# EasyEDA schematic SCH_New-Project_2024-12-08_14-09-2234_2024-12-08.json
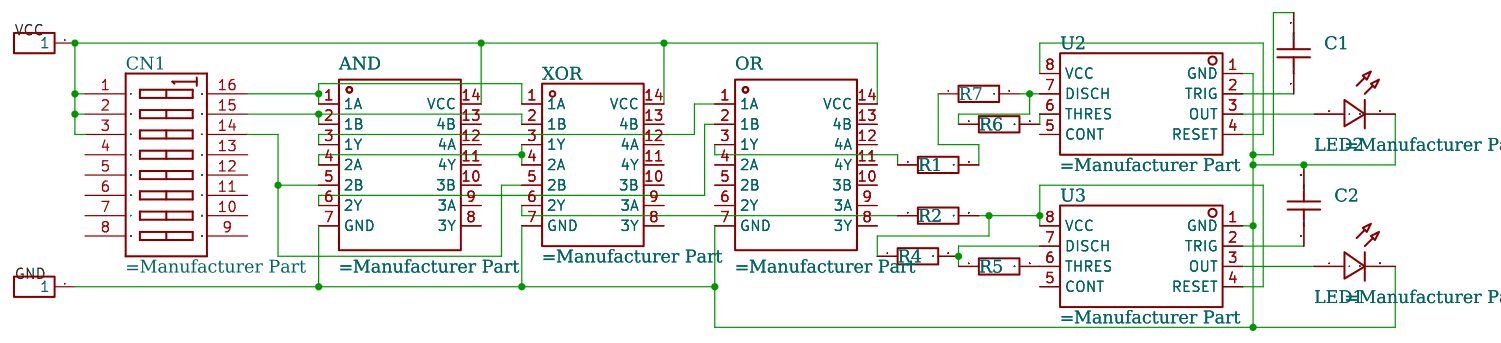
[diagram p0: schematic sheet]

## Parts
AND  =Manufacturer Part  [DIP-14_L19.2-W6.6-P2.54-LS10.9-BL]
C1  100uF  [CAP-TH_BD8.0-P3.50-D0.6-FD-2]
C2  100uF  [CAP-TH_BD8.0-P3.50-D0.6-FD-2]
CN1  =Manufacturer Part  [SW-TH_DS-08RP]
H1  =Manufacturer Part  [CONN-SMD_2059-301-998-403]
H2  =Manufacturer Part  [CONN-SMD_2059-301-998-403]
LED1  =Manufacturer Part  [LED-TH_BD3.2-P2.54-FD]
LED2  =Manufacturer Part  [LED-TH_BD3.2-P2.54-FD]
OR  =Manufacturer Part  [DIP-14_L19.0-W7.0-P2.54-LS7.6-BL]
R1  1kΩ  [R0402]
R2  1kΩ  [R0402]
R4  1kΩ  [R0402]
R5  1kΩ  [R0402]
R6  1kΩ  [R0402]
R7  1kΩ  [R0402]
U2  =Manufacturer Part  [DIP-8_L9.7-W6.4-P2.54-LS7.6-BL]
U3  =Manufacturer Part  [DIP-8_L9.7-W6.4-P2.54-LS7.6-BL]
XOR  =Manufacturer Part  [DIP-14_L20.0-W7.6-P2.54-LS8.0-BL]

## Library data of the parts
AND = -: Logic Gate Type:与门 Number of Channels:4 Supply Voltage:2V6V Supply Voltage:2V6V Quiescent Current (Max):2uA Sink Current:5.2mA Source Current:5.2mA High Level Range (VIH):1.5V4.2V High Level Range (VIH):1.5V4.2V Low Level Range (VIL):500mV1.8V Low Le; Symbol: 74HC08N; Device: SN74HC08N; LCSC Part Name: SN74HC08N; Supplier Part: C2887; Manufacturer: TI(德州仪器); Manufacturer Part: SN74HC08N; Supplier Footprint: DIP-14; JLCPCB Part Class: Extended Part; Datasheet: https://www.ti.com/cn/lit/gpn/sn74hc08; Supplier: LCSC; Add into BOM: yes; Convert to PCB: yes; Logic Gate Type: 与门; Number of Channels: 4; Supply Voltage: 2V6V; Quiescent Current (Max): 2uA; Sink Current: 5.2mA; Source Current: 5.2mA; High Level Range (VIH): 1.5V4.2V; Low Level Range (VIL): 500mV1.8V; Series: 74HCSeries; Propagation Delay Time: 17ns@6V,50pF; Operating Temperature: -40℃+85℃; Comment: SN74HC08N
C1 C2 = -: Capacitance: Tolerance:±20% Tolerance:±20% Rated Voltage: Ripple Current: Equivalent Series Resistance(ESR): Lead Spacing: φD: L: Lifetime @ Temp:; Symbol: CAP; Device: 50YXJ100MT78X11.5; LCSC Part Name: 100uF ±20% 50V; Supplier Part: C440833; Manufacturer: rubycon(红宝石); Manufacturer Part: 50YXJ100MT78X11.5; Supplier Footprint: 插件,D8xL11.5mm; JLCPCB Part Class: Extended Part; Datasheet: https://atta.szlcsc.com/upload/public/pdf/source/20230810/A68D5411C6D60D4A104C9B6E8FF59617.pdf; Supplier: LCSC; Add into BOM: yes; Convert to PCB: yes; Tolerance: ±20%
CN1 = -: Type:平拨,凸起式 Circuit:SPST Number of Positions:8Bit Lead Pitch:2.54mm Current Rating:25mA Voltage Rating:24V Operating Temperature:-20℃+70℃ Operating Temperature:-20℃+70℃ Operating Life:3千次 Color:Red; Symbol: DS-08RP_C5370280; Device: DS-08RP_C458084; LCSC Part Name: 间距2.54mm 平拨,凸起式 8位拨码开关; Supplier Part: C458084; Manufacturer: 韩国韩荣; Manufacturer Part: DS-08RP; Supplier Footprint: 插件; JLCPCB Part Class: Extended Part; Datasheet: https://atta.szlcsc.com/upload/public/pdf/source/20210810/ECF2F28B1CE673E7F9581E27682BDB10.pdf; Supplier: LCSC; Add into BOM: yes; Convert to PCB: yes; Type: 平拨,凸起式; Circuit: SPST; Number of Positions: 8Bit; Lead Pitch: 2.54mm; Current Rating: 25mA; Voltage Rating: 24V; Operating Temperature: -20℃+70℃; Operating Life: 3千次; Color: Red; Comment: DS-08RP
H1 H2 = -: Structure:1x1P Pitch:- Color:White Mounting Style:- Number of Pins:1P Number of PINs Per Row:1 Current Rating (Max):3A Voltage Rating (Max):600V Wire Gauge - AWG:2226 Wire Gauge - mm2:- Operating Temperature Range:-60℃+105℃ Operating Temperature Range:-; Symbol: HDR_1x1; Device: 2059-301/998-403; LCSC Part Name: 1x1P 每排P数:1 排数:1; Supplier Part: C2765059; Manufacturer: WAGO(万可); Manufacturer Part: 2059-301/998-403; Supplier Footprint: SMD,P=3mm; JLCPCB Part Class: Extended Part; Datasheet: https://atta.szlcsc.com/upload/public/pdf/source/20210406/C2765059_FB1B80C52C532D29E58905F06213D89F.pdf; Supplier: LCSC; Add into BOM: yes; Convert to PCB: yes; Structure: 1x1P; Color: White; Number of Pins: 1P; Number of PINs Per Row: 1; Current Rating (Max): 3A; Voltage Rating (Max): 600V; Wire Gauge - AWG: 2226; Operating Temperature Range: -60℃+105℃; Number of Rows: 1; Comment: 2059-301/998-403
LED1 LED2 = -: Lamp Holder Type:3mm圆形灯头 Emitted Color:Green-yellow Forward Voltage (VF):2.1V Forward Voltage (VF):2.1V Power Dissipation:120mW Forward Current:20mA Dominant Wavelength:569nm Dominant Wavelength:569nm Peak Wavelength:565nm Diode Configuration:- Lens Color; Symbol: LED_R; Device: LTL-4231N; LCSC Part Name: 普绿/黄绿; Supplier Part: C125082; Manufacturer: LITEON(光宝); Manufacturer Part: LTL-4231N; Supplier Footprint: 插件,D=3mm; JLCPCB Part Class: Extended Part; Datasheet: https://atta.szlcsc.com/upload/public/pdf/source/20180326/C125082_0C1E1300406BD844B73428E23567D967.pdf; Supplier: LCSC; Add into BOM: yes; Convert to PCB: yes; Lamp Holder Type: 3mm圆形灯头; Emitted Color: Green-yellow; Forward Voltage (VF): 2.1V; Power Dissipation: 120mW; Forward Current: 20mA; Dominant Wavelength: 569nm; Peak Wavelength: 565nm; Lens Color: 雾状绿透镜; Luminous Intensity: 12.6mcd; Viewing Angle: 60°; Operating Temperature: -55℃+100℃; Comment: LTL-4231N
OR = -: Logic Gate Type:ORGate Number of Channels:4 Supply Voltage:2V6V Supply Voltage:2V6V Quiescent Current (Max):2uA Sink Current:5.2mA Source Current:5.2mA High Level Range (VIH):1.5V4.2V High Level Range (VIH):1.5V4.2V Low Level Range (VIL):500mV1.8V Lo; Symbol: SN74HC32N; Device: SN74HC32N; LCSC Part Name: SN74HC32N; Supplier Part: C2894; Manufacturer: TI(德州仪器); Manufacturer Part: SN74HC32N; Supplier Footprint: DIP-14; JLCPCB Part Class: Extended Part; Datasheet: https://www.ti.com/cn/lit/gpn/sn74hc32; Supplier: LCSC; Add into BOM: yes; Convert to PCB: yes; Logic Gate Type: ORGate; Number of Channels: 4; Supply Voltage: 2V6V; Quiescent Current (Max): 2uA; Sink Current: 5.2mA; Source Current: 5.2mA; High Level Range (VIH): 1.5V4.2V; Low Level Range (VIL): 500mV1.8V; Series: 74HCSeries; Propagation Delay Time: 17ns@6V,50pF; Operating Temperature: -40℃+85℃; Comment: SN74HC32N
R1 R2 R4-R7 = -: Type:Thick Film Resistors Resistance: Tolerance:±5% Tolerance:±5% Power(Watts): Overload Voltage (Max): Temperature Coefficient:±100ppm/℃ Temperature Coefficient:±100ppm/℃ Operating Temperature Range:-55℃+155℃ Operating Temperature Range:-55℃+155℃; Symbol: Res; Device: RC0402JR-071KL; LCSC Part Name: 厚膜电阻 1kΩ ±5% 62.5mW; Supplier Part: C105637; Manufacturer: YAGEO(国巨); Manufacturer Part: RC0402JR-071KL; Supplier Footprint: 0402; JLCPCB Part Class: Extended Part; Datasheet: https://atta.szlcsc.com/upload/public/pdf/source/20180927/C295883_E8D83085EA81BD7DE0B2B681138C15EE.pdf; Supplier: LCSC; Add into BOM: yes; Convert to PCB: yes; Type: Thick Film Resistors; Tolerance: ±5%; Temperature Coefficient: ±100ppm/℃; Operating Temperature Range: -55℃+155℃
U2 U3 = -: Symbol: LM555IN; Device: LM555N; LCSC Part Name: 单精度定时器; Supplier Part: C725327; Manufacturer: HGSEMI(华冠); Manufacturer Part: LM555N; Supplier Footprint: DIP-8; JLCPCB Part Class: Extended Part; Datasheet: https://atta.szlcsc.com/upload/public/pdf/source/20200820/C725327_523C7FBD163769615688D4EAFE352537.pdf; Supplier: LCSC; Add into BOM: yes; Convert to PCB: yes; Comment: LM555N
XOR = -: Logic Gate Type:XORGate Number of Channels:4 Supply Voltage:2V6V Supply Voltage:2V6V Quiescent Current (Max):2uA Sink Current:5.2mA Source Current:5.2mA High Level Range (VIH):1.5V4.2V High Level Range (VIH):1.5V4.2V Low Level Range (VIL):500mV1.8V L; Symbol: SN74HC86N; Device: SN74HC86N; LCSC Part Name: SN74HC86N; Supplier Part: C2903; Manufacturer: TI(德州仪器); Manufacturer Part: SN74HC86N; Supplier Footprint: DIP-14; JLCPCB Part Class: Extended Part; Datasheet: https://www.ti.com/cn/lit/gpn/sn74hc86; Supplier: LCSC; Add into BOM: yes; Convert to PCB: yes; Logic Gate Type: XORGate; Number of Channels: 4; Supply Voltage: 2V6V; Quiescent Current (Max): 2uA; Sink Current: 5.2mA; Source Current: 5.2mA; High Level Range (VIH): 1.5V4.2V; Low Level Range (VIL): 500mV1.8V; Series: 74HCSeries; Propagation Delay Time: 17ns@6V,50pF; Operating Temperature: -40℃+85℃; Comment: SN74HC86N

## Nets
Net-(AND-1): AND.1(1A) CN1.16 XOR.1(1A)
Net-(AND-2): AND.2(1B) CN1.15 XOR.2(1B)
Net-(AND-3): AND.3(1Y) OR.1(1A)
Net-(AND-4): AND.4(2A) XOR.3(1Y) XOR.4(2A)
Net-(AND-5): AND.5(2B) CN1.14 XOR.5(2B)
Net-(AND-6): AND.6(2Y) OR.2(1B)
Net-(AND-7): AND.7(GND) C1.2 C2.2 H1.1 LED1.2(C) LED2.2(C) OR.7(GND) U2.1(GND) U3.1(GND) XOR.7(GND)
Net-(AND-14): AND.14(VCC) CN1.1(A1) CN1.2(A2) CN1.3(A3) H2.1 OR.14(VCC) XOR.14(VCC)
Net-(C1-1): C1.1 U2.2(TRIG)
Net-(C2-1): C2.1 U3.2(TRIG)
Net-(LED1-1): LED1.1(A) U3.3(OUT)
Net-(LED2-1): LED2.1(A) U2.3(OUT)
Net-(OR-3): OR.3(1Y) R1.1
Net-(R1-2): R1.2 R7.1
Net-(R2-1): R2.1 XOR.6(2Y)
Net-(R2-2): R2.2 R4.1 U3.4(RESET) U3.8(VCC)
Net-(R4-2): R4.2 R5.1 U3.7(DISCH)
Net-(R5-2): R5.2 U3.6(THRES)
Net-(R6-1): R6.1 R7.2 U2.7(DISCH)
Net-(R6-2): R6.2 U2.6(THRES)
Net-(U2-4): U2.4(RESET) U2.8(VCC)

Not connected (* = marked no-connect by the designer): AND 8(3Y) 9(3A) 10(3B) 11(4Y) 12(4A) 13(4B); CN1 4(A4) 5(A5) 6(A6) 7(A7) 8(A8) 9 10 11 12 13; OR 4(2A) 5(2B) 6(2Y) 8(3Y) 9(3A) 10(3B) 11(4Y) 12(4A) 13(4B); U2 5(CONT); U3 5(CONT); XOR 8(3Y) 9(3A) 10(3B) 11(4Y) 12(4A) 13(4B)

## Notes on the sheet
- 1
- 2
- 3
- 4
- 5
- 6
- A
- A
- B
- B
- C
- C
- Schematic1
- Update Date
- 2024-12-08
- Schematic
- Create Date
- 2024-12-08
- Page
- P1
- Part Number
- JLCPCB-002
- Drawn
- EasyEDA
- New Project_2024-12-08_14-09-2234
- D
- Reviewed
- EasyEDA
- D
- VER
- SIZE
- PAGE
- 1
- OF
- 1
- V0.1
- A4
- EasyEDA.com
- 1
- 2
- 3
- 4
- 5
- 6
